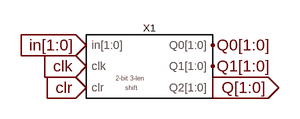
[diagram p0: schematic shift_reg-2bit-3len.asc]
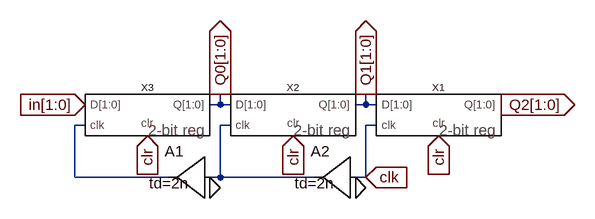
[diagram p1: sub-circuit shift_reg-2bit-3len-full.asc]
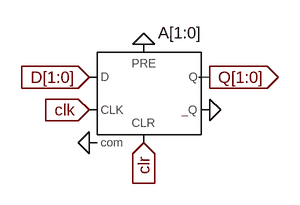
[diagram p2: sub-circuit dbuf_2bit.asc]
shift_reg-2bit-3len.asc, the LTspice schematic file:
Version 4
SHEET 1 908 680
FLAG 256 160 clr
IOPIN 256 160 In
FLAG 256 128 clk
IOPIN 256 128 In
FLAG 256 96 in[1:0]
IOPIN 256 96 In
FLAG 448 96 Q0[1:0]
FLAG 448 128 Q1[1:0]
FLAG 448 160 Q[1:0]
IOPIN 448 160 Out
SYMBOL shift_reg-2bit-3len-full 352 128 R0
SYMATTR InstName X1

shift_reg-2bit-3len-full.asc, the sub-circuit schematic file:
Version 4
SHEET 1 908 680
WIRE 256 96 256 80
WIRE 256 96 240 96
WIRE 272 96 256 96
WIRE 480 96 480 80
WIRE 480 96 464 96
WIRE 496 96 480 96
WIRE 48 128 32 128
WIRE 272 128 256 128
WIRE 496 128 480 128
WIRE 32 208 32 128
WIRE 176 208 32 208
WIRE 256 208 256 128
WIRE 256 208 240 208
WIRE 400 208 256 208
WIRE 480 208 480 128
WIRE 480 208 464 208
FLAG 144 144 clr
IOPIN 144 144 In
FLAG 368 144 clr
IOPIN 368 144 In
FLAG 592 144 clr
IOPIN 592 144 In
FLAG 240 224 0
FLAG 480 208 clk
IOPIN 480 208 In
FLAG 464 224 0
FLAG 48 96 in[1:0]
IOPIN 48 96 In
FLAG 688 96 Q2[1:0]
IOPIN 688 96 Out
FLAG 256 80 Q0[1:0]
IOPIN 256 80 Out
FLAG 480 80 Q1[1:0]
IOPIN 480 80 Out
SYMBOL Digital\\buf1 464 144 M0
WINDOW 3 32 73 Left 0
SYMATTR Value td=2n
SYMATTR InstName A2
SYMBOL dbuf_2bit 592 112 R0
SYMATTR InstName X1
SYMBOL dbuf_2bit 368 112 R0
SYMATTR InstName X2
SYMBOL dbuf_2bit 144 112 R0
SYMATTR InstName X3
SYMBOL Digital\\buf1 240 144 M0
WINDOW 3 32 73 Left 0
SYMATTR Value td=2n
SYMATTR InstName A1

dbuf_2bit.asc, the sub-circuit schematic file:
Version 4
SHEET 1 880 680
WIRE 224 128 208 128
FLAG 48 224 0
FLAG 224 128 Q[1:0]
IOPIN 224 128 Out
FLAG 128 224 clr
IOPIN 128 224 In
FLAG 48 128 D[1:0]
IOPIN 48 128 In
FLAG 48 176 clk
IOPIN 48 176 In
FLAG 224 176 0
FLAG 128 80 0
SYMBOL Digital\\dflop 128 80 R0
WINDOW 0 21 -17 Left 2
SYMATTR InstName A[1:0]

The netlist it stands for:
* shift_reg-2bit-3len.asc
XX1 clk clr in[1] in[0] Q0[1] Q0[0] Q1[1] Q1[0] Q[1] Q[0] shift_reg-2bit-3len-full

* block symbol definitions
.subckt shift_reg-2bit-3len-full clk clr in[1] in[0] Q0[1] Q0[0] Q1[1] Q1[0] Q2[1] Q2[0]
A2 clk 0 0 0 0 0 N002 0 BUF td=2n
XX1 clk clr Q1[1] Q1[0] Q2[1] Q2[0] dbuf_2bit
XX2 N002 clr Q0[1] Q0[0] Q1[1] Q1[0] dbuf_2bit
XX3 N001 clr in[1] in[0] Q0[1] Q0[0] dbuf_2bit
A1 N002 0 0 0 0 0 N001 0 BUF td=2n
.ends shift_reg-2bit-3len-full

.subckt dbuf_2bit clk clr D[1] D[0] Q[1] Q[0]
A[1:0] D[1:0] 0 clk 0 clr 0 Q[1:0] 0 DFLOP
.ends dbuf_2bit

.backanno
.end